# Altium schematic sheet Sheet1.SchDoc
size 431 x 279 mm; SheetNumber: 1; SheetTotal: 1; ENG_APP_DATE: --/--/--; DSN_APP_DATE: --/--/--; CHK_APP_DATE: --/--/--
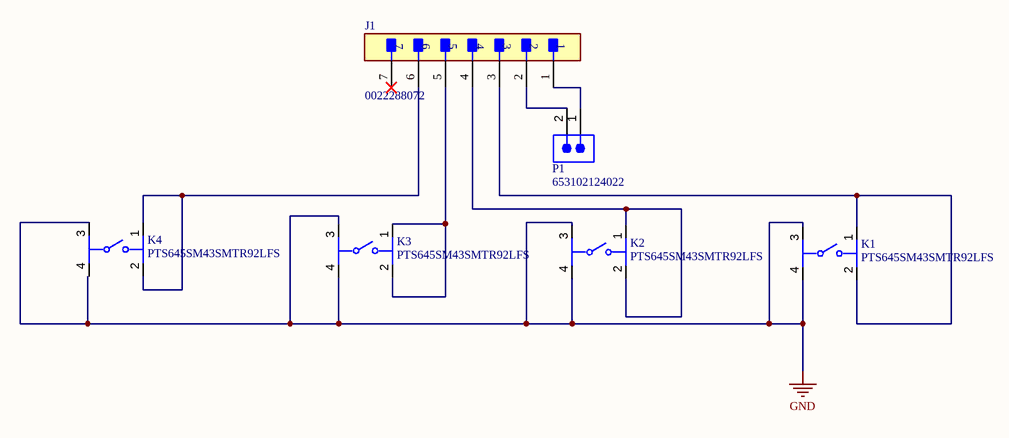
[diagram p0: Sheet1.SchDoc]

## Parts
J1  0022288072  [FP-0022288072-MFG]
K1  PTS645SM43SMTR92LFS  [FP-PTS645SM43SMTR92LFS-MFG]
K2  PTS645SM43SMTR92LFS  [FP-PTS645SM43SMTR92LFS-MFG]
K3  PTS645SM43SMTR92LFS  [FP-PTS645SM43SMTR92LFS-MFG]
K4  PTS645SM43SMTR92LFS  [FP-PTS645SM43SMTR92LFS-MFG]
P1  653102124022  [653102124022]

## Nets
GND: K1.3 K1.4 K2.3 K2.4 K3.3 K3.4 K4.3
NetJ1_1: J1.1 P1.1
NetJ1_2: J1.2 P1.2
NetJ1_3: J1.3 K1.1 K1.2
NetJ1_4: J1.4 K2.1 K2.2
NetJ1_5: J1.5 K3.1 K3.2
NetJ1_6: J1.6 K4.1 K4.2

Not connected (* = marked no-connect by the designer): J1 7*; K4 4

## Notes on the sheet
- DWG. NO.
- REV.
- SHT.
- THIS DOCUMENT AND THE DATA DISCLOSED HEREIN OR HEREWITH IS THE PROPERTY OF ALTIUM LIMITED AND MAY BE FREELY DISTRIBUTED IN WHOLE. NO RIGHTS ARE RESERVED OR EXPRESS OR IMPLIED WARANTEE GIVEN.
- REVISION
- DESCRIPTION
- DATE
- APPROVED
- ENG:
- APPROVALS
- PROJECT
- DSN:
- CHK:
- REFERENCE DOCUMENTS
- PROJECT REVISION:
- TITLE
- DOCUMENT REVISION:
- DESIGN ITEM:
- BOM:
- FAB DWG:
- PCB DWG:
- ASSY DWG:
- SCALE:
- SIZE
- B
- CAGE CODE
- FILE NAME
- DWG NO.
- SHEET
- OF
- REV

## Library data of the parts
J1 = CMP-00257-17768919-1: 0022288072 KK 254 Breakaway Header Right-Angle Surface Mount Compatible 7 Circuits 0.38; Manufacturer Lifecycle Status: ACTIVE; Pitch: 2.54mm; Number of Positions: 7; Plating: Tin; Max Voltage Rating (AC): 250V; Contact Resistance: 20mΩ; Current Rating: 4A; Gender: Male; Connector Type: Male Pin; Schedule B: 8536694040, 8536694040; Number of Circuits: 7; Contact Plating: Gold; Country of Origin: US; Max Operating Temperature: 75°C; Color: Black; Housing Color: Black; Number of Contacts: 7; Housing Material: Thermoplastic; Contact Material: Brass; Depth: 10.27mm; Min Operating Temperature: 0°C; Orientation: Right Angle; Termination: Solder; Lead Free: Lead Free; Length: 17.78mm; Contact Mating Length: 6.1976mm; Packaging: Bulk; RoHS: Compliant; Number of Rows: 1; NexarPartId: 17768919; Mount: Through Hole; Lifecycle Status: Production
K1-K4 = CMP-2000-05160-2: SWITCH TACTILE SPST-NO 0.05A 12V; Contact Resistance: 100mR; Throw Configuration: SPST; Illumination Type: Non-Illuminated; Mechanical Life: 100000Cycles; Current Rating: 50mA; Switch Function: Off-Mom; Actuator Length: 0.85mm; Actuator Material: Nylon; Actuator Type: Standard; Operating Force: 160gf; Min Operating Temperature: -20°C; REACH SVHC: No SVHC; Termination: Gull Wing; Case/Package: SMD/SMT; Packaging: Tape and Reel; Mount: Surface Mount; Voltage Rating (DC): 12V; Orientation: Straight; Lead Free: Lead Free; Contact Material: Silver; Color: Black; Max Current Rating: 50mA; Contact Plating: Silver; Depth: 9mm; Package Quantity: 1; Max Voltage Rating (DC): 12V; Length: 6mm; Max Operating Temperature: 60°C
P1 = CMP-1502-00757-2: NexarPartId: 18818273; Current Rating: 1A; Pitch: 1.25mm; Gender: Male; Connector Type: Male Pin; Insulation Resistance: 100MΩ; Contact Resistance: 20mΩ; Operating Supply Voltage: 125V; Number of Positions: 2; Insulation: Insulated; Number of Pins: 2; Flammability Rating: UL94 V-0; Number of Rows: 1; Termination: SMD/SMT; Width: 7.25mm; Contact Material: Copper; Color: Beige, White; Contact Gender: Male; Housing Material: Nylon; Contact Mating Length: 2.159mm; RoHS: Compliant; Orientation: Vertical; Min Operating Temperature: -40°C; Max Operating Temperature: 85°C; Voltage Rating: 125V; Height: 4.75mm; Packaging: Tape and Reel; Lead Pitch: 1.25mm; Mount: Surface Mount; REACH SVHC: Unknown; Contact Plating: Tin; Length: 7.25mm; Number of Contacts: 2